# Altium project PW-Sat2_EPS_EM_Battery-Controller.PrjPcb
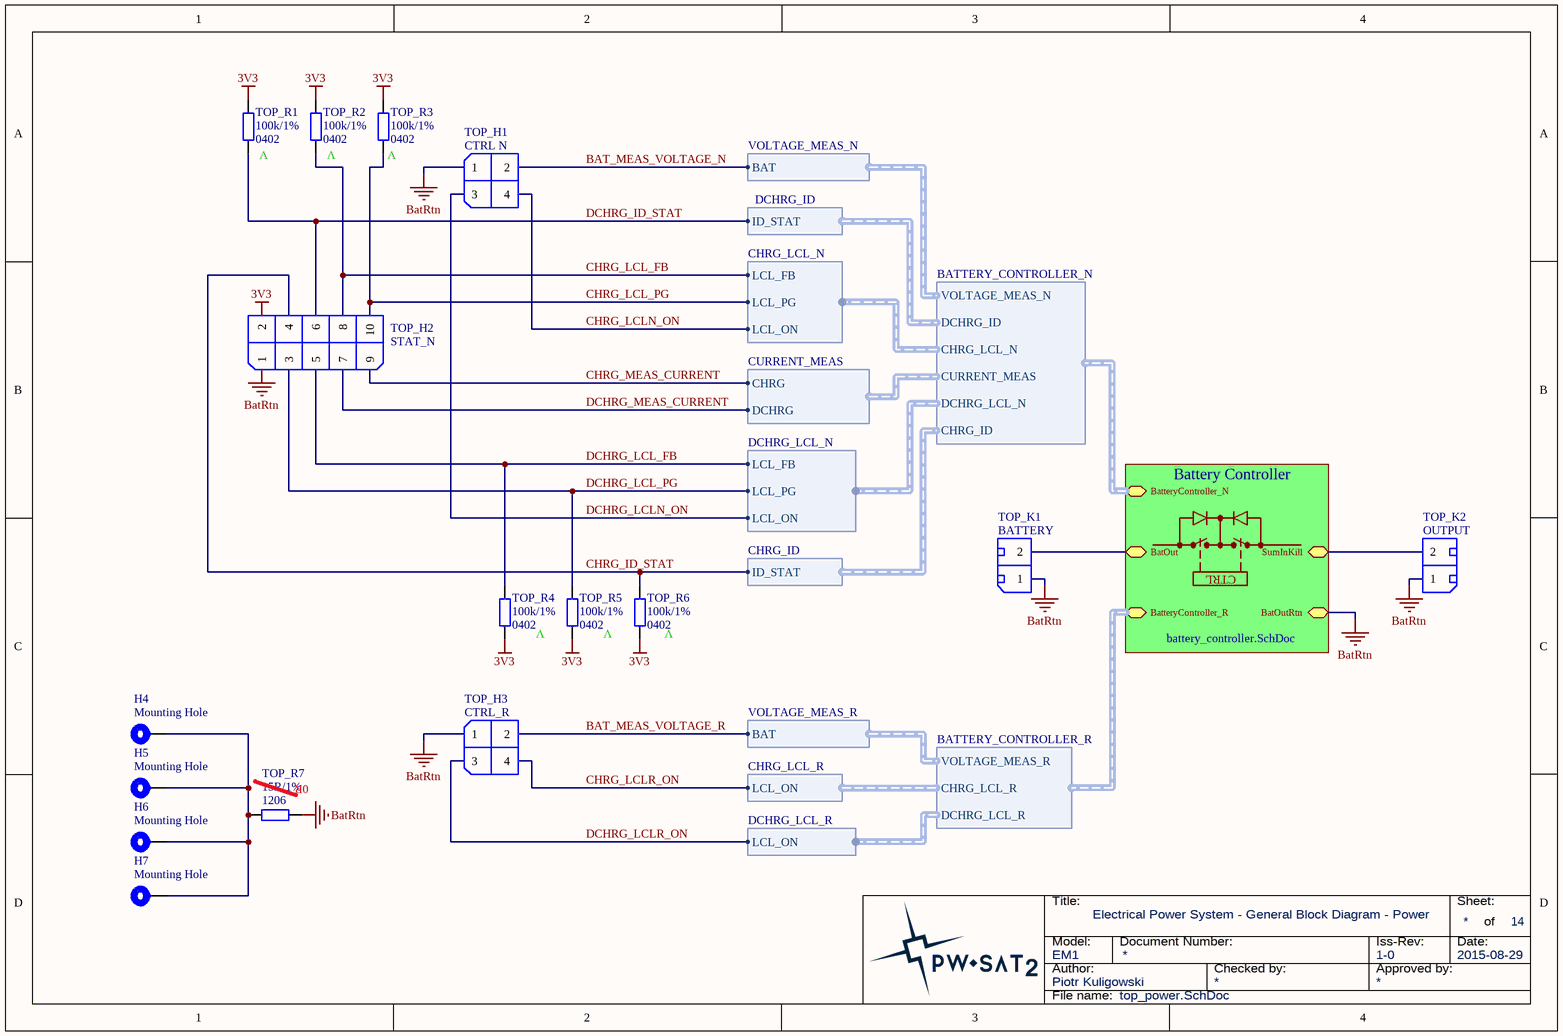
[diagram p0: top_power.SchDoc]
8 sheets, 87 parts. Net scope: hierarchical (ports join the sheet entries above them; power ports are global).
Board file: PW-Sat2_EPS_EM_Battery-Controller.PcbDoc
Sheets:
  top_power.SchDoc
    Battery Controller = battery_controller.SchDoc
      Battery Current Meas. = battery_current-meas.SchDoc
      Battery Charger - Ideal Diode = battery_diode-charging.SchDoc
      Battery Discharger - Ideal Diode = battery_diode-discharging.SchDoc
      Battery Charger - LCL = battery_lcl-charging.SchDoc
      Battery Discharger - LCL = battery_lcl-discharging.SchDoc
      Battery Voltage Meas. = battery_voltage-meas.SchDoc

## Sheet top_power.SchDoc: Electrical Power System - General Block Diagram - Power
size A4; Date: 2015-08-29; Author: Piotr Kuligowski; Revision: 1-0; SheetTotal: 14; Model: EM1; PageSetup: Record=PageOptions|CenterHorizontal=True|CenterVertical=True|PrintScale=0.52|XCorrection=1.00|YCorrection=1.00|PrintKind=1|BorderSize=5000000|LeftOffset=0|BottomOffset=0|Orientation=2|PaperLength=4200|PaperWidth=2970|Scale=100|PaperSource=7|PrintQuality=600|MediaType=1|DitherType=10|PaperKind=A3|PrintScaleMode=1

### Parts
H4  Mounting Hole  [PC-104_PcbMntHole_M3]
H5  Mounting Hole  [PC-104_PcbMntHole_M3]
H6  Mounting Hole  [PC-104_PcbMntHole_M3]
H7  Mounting Hole  [PC-104_PcbMntHole_M3]
TOP_H1  CTRL N  [Harwin_Datamate_L-Tek_M80-8670405]
TOP_H2  STAT_N  [Harwin_Datamate_L-Tek_M80-8671005]
TOP_H3  CTRL_R  [Harwin_Datamate_L-Tek_M80-8670405]
TOP_K1  ProviderPartNumber: BATTERY  [TerminalBlock_Spring_2.54_2-R]  (hidden comment: TB-2.5-PD-xx)
TOP_K2  ProviderPartNumber: OUTPUT  [TerminalBlock_Spring_2.54_2-R]  (hidden comment: TB-2.5-PD-xx)
TOP_R1  Package: 0402  [SMD_Resistor_0402]  (hidden comment: 100k/1%)
TOP_R2  Package: 0402  [SMD_Resistor_0402]  (hidden comment: 100k/1%)
TOP_R3  Package: 0402  [SMD_Resistor_0402]  (hidden comment: 100k/1%)
TOP_R4  Package: 0402  [SMD_Resistor_0402]  (hidden comment: 100k/1%)
TOP_R5  Package: 0402  [SMD_Resistor_0402]  (hidden comment: 100k/1%)
TOP_R6  Package: 0402  [SMD_Resistor_0402]  (hidden comment: 100k/1%)
TOP_R7  Package: 1206  [SMD_Resistor_1206]  (hidden comment: 15R/1%)

### Sub-sheets
Battery Controller = battery_controller.SchDoc: SumInKill, BatOut, BatOutRtn, BatteryController_N (harness BATTERY_CONTROLLER_N), BatteryController_R (harness BATTERY_CONTROLLER_R)

### Harnesses
BATTERY_CONTROLLER_N: DCHRG_ID, CHRG_LCL_N, CURRENT_MEAS, DCHRG_LCL_N, CHRG_ID, VOLTAGE_MEAS_N
VOLTAGE_MEAS_N: BAT
DCHRG_ID: ID_STAT
CHRG_LCL_N: LCL_FB, LCL_PG, LCL_ON
CURRENT_MEAS: CHRG, DCHRG
DCHRG_LCL_N: LCL_FB, LCL_PG, LCL_ON
CHRG_ID: ID_STAT
BATTERY_CONTROLLER_R: DCHRG_LCL_R, CHRG_LCL_R, VOLTAGE_MEAS_R
VOLTAGE_MEAS_R: BAT
CHRG_LCL_R: LCL_ON
DCHRG_LCL_R: LCL_ON

### Nets
3V3: TOP_H2.2 TOP_R1.1 TOP_R2.1 TOP_R3.1 TOP_R4.2 TOP_R5.2 TOP_R6.2
BatRtn: TOP_H1.1 TOP_H2.1 TOP_H3.1 TOP_K1.1 TOP_K2.1 TOP_R7.2 ; sheet Battery Controller/BatOutRtn  [project net BAT_RTN]
BAT_MEAS_VOLTAGE_N: TOP_H1.2 ; harness VOLTAGE_MEAS_N.BAT
BAT_MEAS_VOLTAGE_R: TOP_H3.2 ; harness VOLTAGE_MEAS_R.BAT
CHRG_ID_STAT: TOP_H2.4 TOP_R6.1 ; harness CHRG_ID.ID_STAT
CHRG_LCL_FB: TOP_H2.8 TOP_R2.2 ; harness CHRG_LCL_N.LCL_FB
CHRG_LCL_PG: TOP_H2.10 TOP_R3.2 ; harness CHRG_LCL_N.LCL_PG
CHRG_LCLN_ON: TOP_H1.4 ; harness CHRG_LCL_N.LCL_ON
CHRG_LCLR_ON: TOP_H3.4 ; harness CHRG_LCL_R.LCL_ON
CHRG_MEAS_CURRENT: TOP_H2.9 ; harness CURRENT_MEAS.CHRG
DCHRG_ID_STAT: TOP_H2.6 TOP_R1.2 ; harness DCHRG_ID.ID_STAT
DCHRG_LCL_FB: TOP_H2.5 TOP_R4.1 ; harness DCHRG_LCL_N.LCL_FB
DCHRG_LCL_PG: TOP_H2.3 TOP_R5.1 ; harness DCHRG_LCL_N.LCL_PG
DCHRG_LCLN_ON: TOP_H1.3 ; harness DCHRG_LCL_N.LCL_ON
DCHRG_LCLR_ON: TOP_H3.3 ; harness DCHRG_LCL_R.LCL_ON
DCHRG_MEAS_CURRENT: TOP_H2.7 ; harness CURRENT_MEAS.DCHRG
NetBATV_R1_1: TOP_K1.2 ; sheet Battery Controller/BatOut
NetCHRG_C3_1: TOP_K2.2 ; sheet Battery Controller/SumInKill
NetH4_1: H4.1 H5.1 H6.1 H7.1 TOP_R7.1

### Notes on the sheet
- (near TOP_R1) V
- (near TOP_R2) V
- (near TOP_R3) V
- CTRL
- (near TOP_R5) V
- (near TOP_R6) V
- (near TOP_R7) 0R
- Title:
- Sheet:
- of
- Author:
- Model:
- Document Number:
- Checked by:
- Iss-Rev:
- Approved by:
- Date:
- File name:

### Library data of the parts
H4-H7 = MntHole: PCB Mounting Hole; Value: Mounting Hole
TOP_H1 TOP_H3 = Harwin_Datamate_L-Tek_2x2pin: Harwin DataMate L-Tek, 2mm pitch, 2x2pin.; Value: Harwin DataMate L-Tek 2x2pin
TOP_H2 = Harwin_Datamate_L-Tek_2x5pin: Harwin DataMate L-Tek, 2mm pitch, 2x5pin.; Value: Harwin DataMate L-Tek 2x5pin
TOP_K1 TOP_K2 = TerminalBlock_Spring_2.54_2-R: Terminal block with spring, 2-pin, 2.54mm pitch, right angle.; Provider: TME.eu; Value: TB-2.5-PD-xx
TOP_R1-TOP_R6 = CRCW0402100KFKxxxx: 100k/1% Vishay CRCW 0402 Resistor. 63mW, 100ppm, 50V.; Manufacturer: Vishay; Value: 100k/1%
TOP_R7 = CRCW120615R0FKxxxx: 15R/1% Vishay CRCW 1206 Resistor. 250mW, 100ppm, 200V.; ManufacturerPartNumber: CRCW120615R0FKxxxx; Manufacturer: Vishay; Value: 15R/1%

## Sheet battery_controller.SchDoc: Battery Controller
size A3; Date: 2015-09-21; Author: Piotr Kuligowski; DocumentNumber: 1; Revision: 1-0; SheetNumber: 1; SheetTotal: 14; Model: EM1
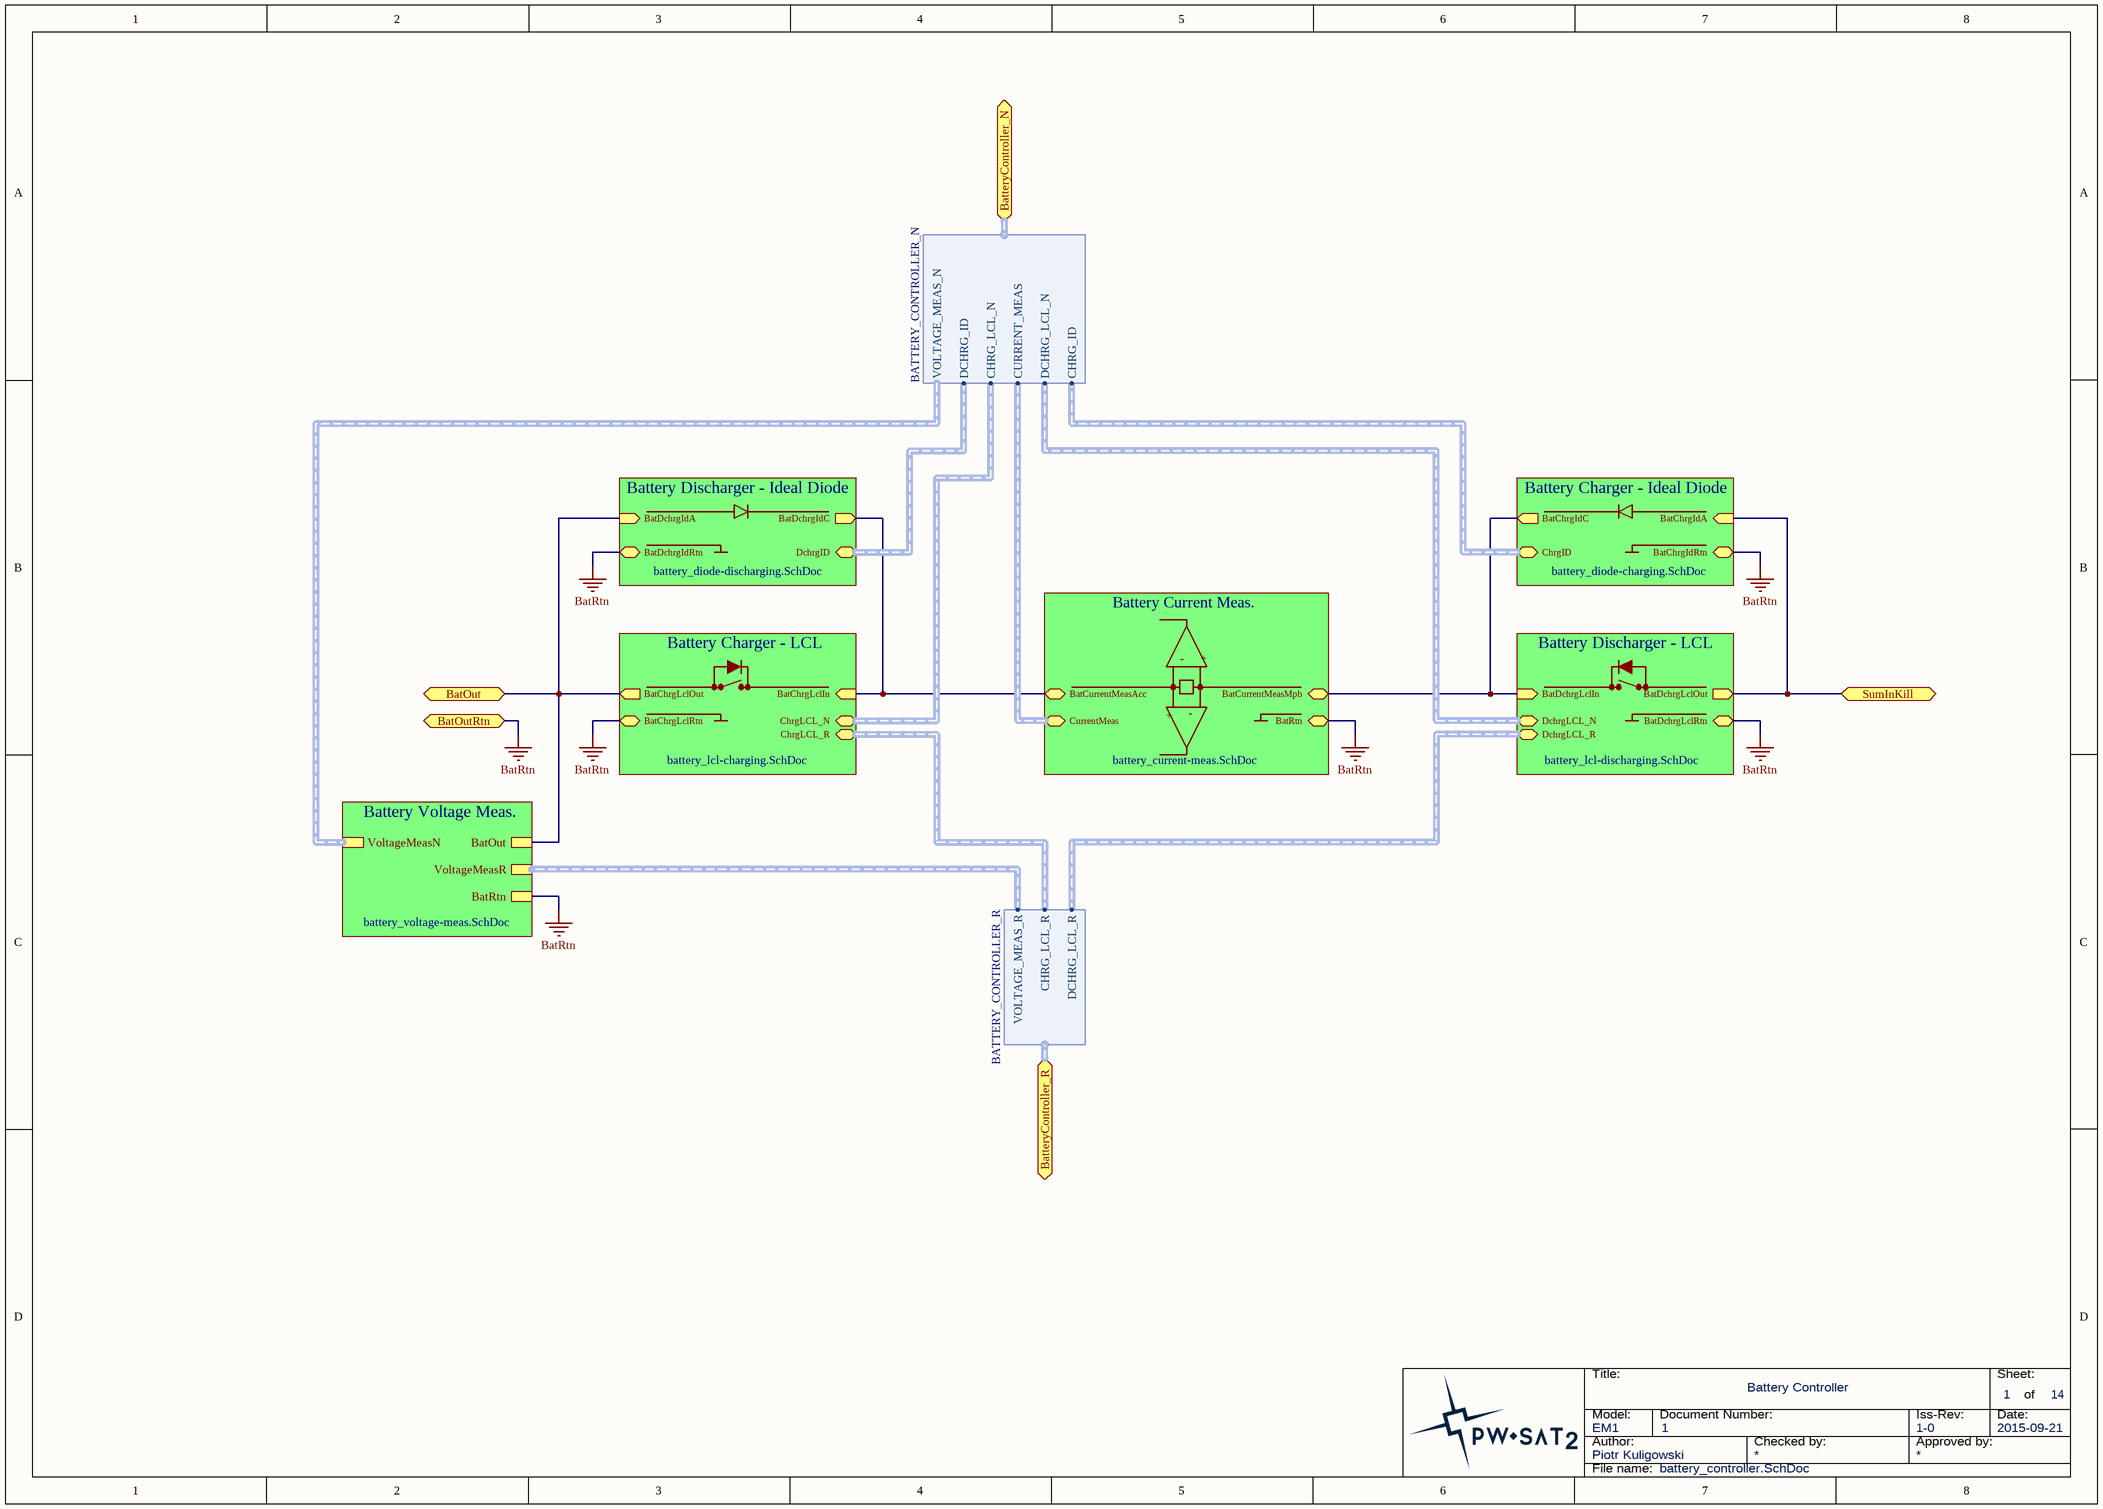
[diagram p1: battery_controller.SchDoc]

### Sub-sheets
Battery Charger - Ideal Diode = battery_diode-charging.SchDoc: BatChrgIdRtn, BatChrgIdA (in), ChrgID (harness CHRG_ID), BatChrgIdC (out)
Battery Charger - LCL = battery_lcl-charging.SchDoc: BatChrgLclIn (in), BatChrgLclRtn, BatChrgLclOut (out), ChrgLCL_N (harness CHRG_LCL_N), ChrgLCL_R (harness CHRG_LCL_R)
Battery Current Meas. = battery_current-meas.SchDoc: BatCurrentMeasMpb, BatRtn, BatCurrentMeasAcc, CurrentMeas (harness CURRENT_MEAS)
Battery Discharger - Ideal Diode = battery_diode-discharging.SchDoc: BatDchrgIdRtn, BatDchrgIdA (in), DchrgID (harness DCHRG_ID), BatDchrgIdC (out)
Battery Discharger - LCL = battery_lcl-discharging.SchDoc: BatDchrgLclIn (in), BatDchrgLclRtn, BatDchrgLclOut (out), DchrgLCL_N (harness DCHRG_LCL_N), DchrgLCL_R (harness DCHRG_LCL_R)
Battery Voltage Meas. = battery_voltage-meas.SchDoc: BatOut, VoltageMeasN (harness VOLTAGE_MEAS_N), VoltageMeasR (harness VOLTAGE_MEAS_R), BatRtn

### Ports
BatOut, BatOutRtn, BatteryController_N (harness BATTERY_CONTROLLER_N), BatteryController_R (harness BATTERY_CONTROLLER_R), SumInKill

### Harnesses
BATTERY_CONTROLLER_N: DCHRG_ID, CHRG_LCL_N, CURRENT_MEAS, DCHRG_LCL_N, CHRG_ID, VOLTAGE_MEAS_N
BATTERY_CONTROLLER_R: DCHRG_LCL_R, CHRG_LCL_R, VOLTAGE_MEAS_R

### Nets
BatRtn: port BatOutRtn, sheet Battery Current Meas./BatRtn, sheet Battery Charger - Ideal Diode/BatChrgIdRtn, sheet Battery Discharger - Ideal Diode/BatDchrgIdRtn, sheet Battery Charger - LCL/BatChrgLclRtn, sheet Battery Discharger - LCL/BatDchrgLclRtn, sheet Battery Voltage Meas./BatRtn  [project net BAT_RTN]
NetBAT_C1_1: sheet Battery Current Meas./BatCurrentMeasAcc, sheet Battery Discharger - Ideal Diode/BatDchrgIdC, sheet Battery Charger - LCL/BatChrgLclIn
NetBAT_C2_1: sheet Battery Current Meas./BatCurrentMeasMpb, sheet Battery Charger - Ideal Diode/BatChrgIdC, sheet Battery Discharger - LCL/BatDchrgLclIn
NetBATV_R1_1: port BatOut, sheet Battery Discharger - Ideal Diode/BatDchrgIdA, sheet Battery Charger - LCL/BatChrgLclOut, sheet Battery Voltage Meas./BatOut
NetCHRG_C3_1: port SumInKill, sheet Battery Charger - Ideal Diode/BatChrgIdA, sheet Battery Discharger - LCL/BatDchrgLclOut

### Notes on the sheet
- +
- -
- Title:
- Sheet:
- of
- Author:
- Model:
- Document Number:
- Checked by:
- Iss-Rev:
- Approved by:
- Date:
- File name:

## Sheet battery_current-meas.SchDoc: Battery Current Measurement
size A4; Date: 2015-09-21; Author: Piotr Kuligowski; DocumentNumber: 1; Revision: 1-0; SheetNumber: 1; SheetTotal: 14; Model: EM1
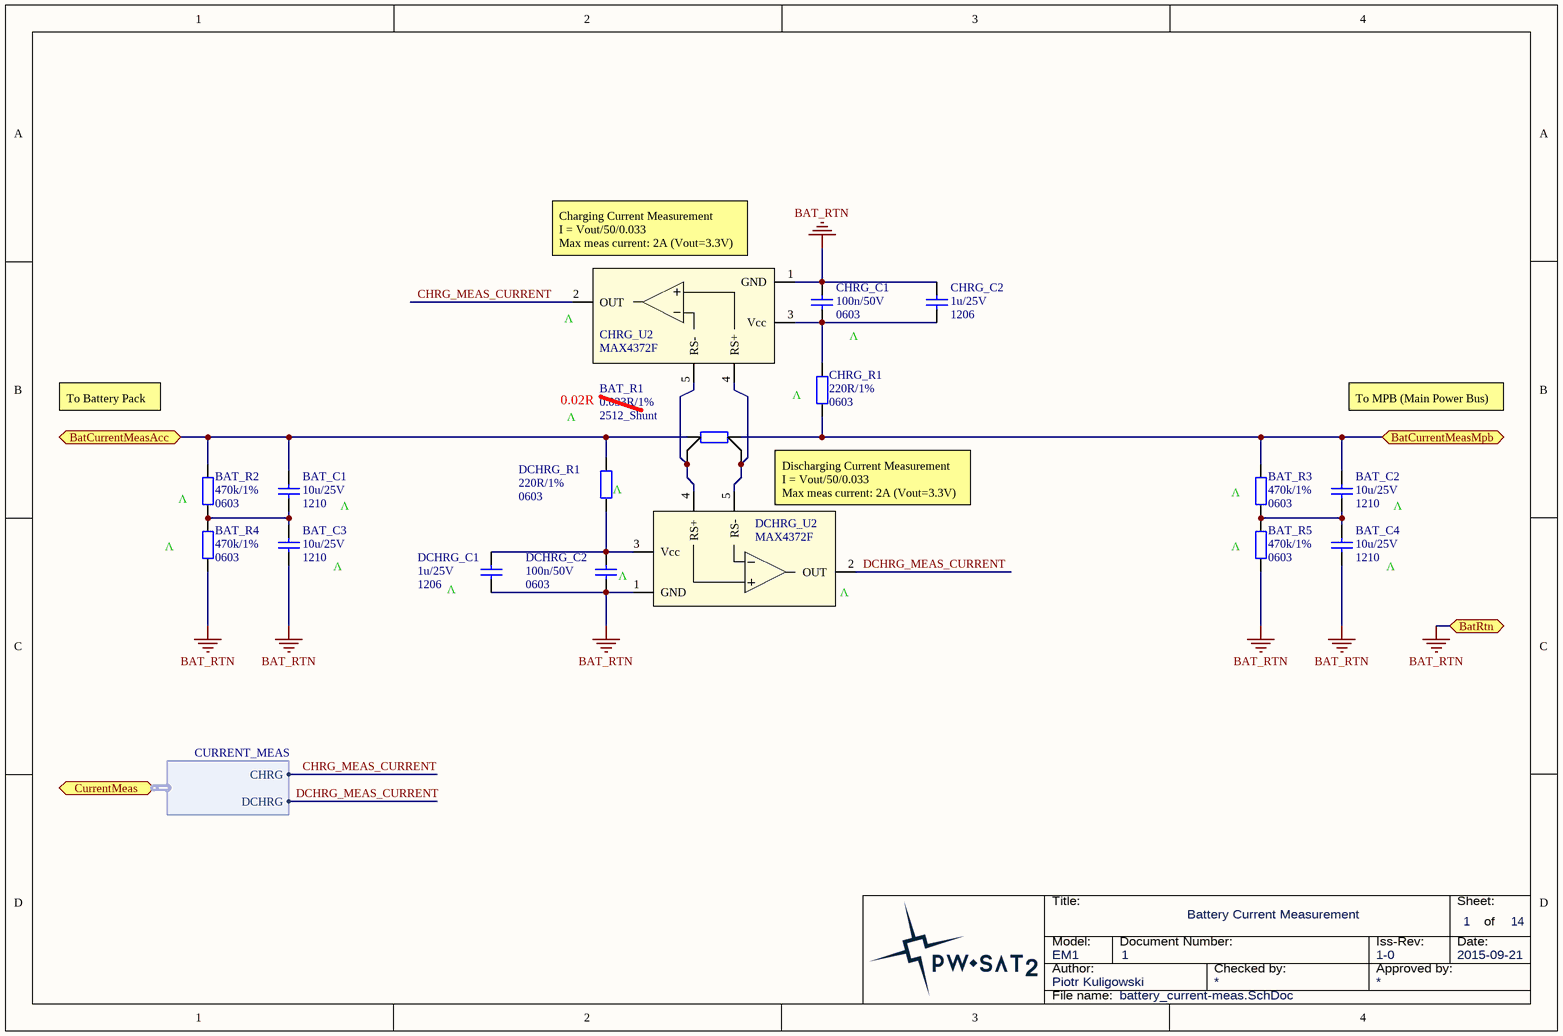
[diagram p2: battery_current-meas.SchDoc]

### Parts
BAT_C1  Package: 1210  [SMD_Capacitor_1210]  (hidden comment: 10u/25V)
BAT_C2  Package: 1210  [SMD_Capacitor_1210]  (hidden comment: 10u/25V)
BAT_C3  Package: 1210  [SMD_Capacitor_1210]  (hidden comment: 10u/25V)
BAT_C4  Package: 1210  [SMD_Capacitor_1210]  (hidden comment: 10u/25V)
BAT_R1  Package: 2512_Shunt  [SMD_Resistor-shunt_2512]  (hidden comment: 0.033R/1%)
BAT_R2  Package: 0603  [SMD_Resistor_0603]  (hidden comment: 470k/1%)
BAT_R3  Package: 0603  [SMD_Resistor_0603]  (hidden comment: 470k/1%)
BAT_R4  Package: 0603  [SMD_Resistor_0603]  (hidden comment: 470k/1%)
BAT_R5  Package: 0603  [SMD_Resistor_0603]  (hidden comment: 470k/1%)
CHRG_C1  Package: 0603  [SMD_Capacitor_0603]  (hidden comment: 100n/50V)
CHRG_C2  Package: 1206  [SMD_Capacitor_1206]  (hidden comment: 1u/25V)
CHRG_R1  Package: 0603  [SMD_Resistor_0603]  (hidden comment: 220R/1%)
CHRG_U2  MAX4372F  [SOT23-5]
DCHRG_C1  Package: 1206  [SMD_Capacitor_1206]  (hidden comment: 1u/25V)
DCHRG_C2  Package: 0603  [SMD_Capacitor_0603]  (hidden comment: 100n/50V)
DCHRG_R1  Package: 0603  [SMD_Resistor_0603]  (hidden comment: 220R/1%)
DCHRG_U2  MAX4372F  [SOT23-5]

### Ports
BatCurrentMeasAcc, BatCurrentMeasMpb, BatRtn, CurrentMeas (harness CURRENT_MEAS)

### Harnesses
CURRENT_MEAS: CHRG, DCHRG

### Nets
BAT_RTN: BAT_C3.2 BAT_C4.2 BAT_R4.2 BAT_R5.2 CHRG_C1.1 CHRG_C2.1 CHRG_U2.1(GND) DCHRG_C1.2 DCHRG_C2.2 DCHRG_U2.1(GND) ; port BatRtn
CHRG_MEAS_CURRENT: CHRG_U2.2(OUT) ; port CurrentMeas.CHRG
DCHRG_MEAS_CURRENT: DCHRG_U2.2(OUT) ; port CurrentMeas.DCHRG
NetBAT_C1_1: BAT_C1.1 BAT_R1.1 BAT_R2.1 DCHRG_R1.1 ; port BatCurrentMeasAcc
NetBAT_C1_2: BAT_C1.2 BAT_C3.1 BAT_R2.2 BAT_R4.1
NetBAT_C2_1: BAT_C2.1 BAT_R1.4 BAT_R3.1 CHRG_R1.1 ; port BatCurrentMeasMpb
NetBAT_C2_2: BAT_C2.2 BAT_C4.1 BAT_R3.2 BAT_R5.1
NetBAT_R1_2: BAT_R1.2 CHRG_U2.5(RS-) DCHRG_U2.4(RS+)
NetBAT_R1_3: BAT_R1.3 CHRG_U2.4(RS+) DCHRG_U2.5(RS-)
NetCHRG_C1_2: CHRG_C1.2 CHRG_C2.2 CHRG_R1.2 CHRG_U2.3(Vcc)
NetDCHRG_C1_1: DCHRG_C1.1 DCHRG_C2.1 DCHRG_R1.2 DCHRG_U2.3(Vcc)

### Notes on the sheet
- (near CHRG_U2) Charging Current Measurement
  I = Vout/50/0.033
  Max meas current: 2A (Vout=3.3V)
- (near CHRG_U2) V
- (near CHRG_R1) V
- V
- To Battery Pack
- (near CHRG_U2) 0.02R
- To MPB (Main Power Bus)
- (near BAT_R2) V
- (near DCHRG_R1) V
- (near DCHRG_U2) Discharging Current Measurement
  I = Vout/50/0.033
  Max meas current: 2A (Vout=3.3V)
- (near BAT_R3) V
- (near DCHRG_C1) V
- (near DCHRG_U2) V
- (near BAT_R5) V
- Title:
- Sheet:
- of
- Author:
- Model:
- Document Number:
- Checked by:
- Iss-Rev:
- Approved by:
- Date:
- File name:

### Library data of the parts
BAT_C1-BAT_C4 = Cer_GCJ32ER71E106KA12L: Ceramic Cap Murata Automotive 10u/25V X7R 1210; Manufacturer: Murata; ManufacturerPartNumber: GCJ32ER71E106KA12L; Value: 10u/25V
BAT_R1 = LR2512-R033FW: 33mR ,1%, 2W, shunt resistor, TE Connectivity.; ManufacturerPartNumber: LR2512-R033FW; Manufacturer: TE Connectivity; Power Rating: 2W; Value: 0.033R/1%
BAT_R2-BAT_R5 = CRCW0603470KFKxxxx: 470k/1% Vishay CRCW 0603 Resistor. 100mW, 100ppm, 75V.; Manufacturer: Vishay; ManufacturerPartNumber: CRCW0603470KFKxxxx; Value: 470k/1%
CHRG_C1 DCHRG_C2 = Cer_GCJ188R71H104KA12D: Ceramic Cap Murata Automotive 100n/50V X7R 0603; Manufacturer: Murata; ManufacturerPartNumber: GCJ188R71H104KA12D; Value: 100n/50V
CHRG_C2 DCHRG_C1 = Cer_C1206T105K3RALTU: Ceramic Cap Kemet COTS 1u/25V X7R 1206; ManufacturerPartNumber: C1206T105K3RALTU; Manufacturer: Kemet; Value: 1u/25V
CHRG_R1 DCHRG_R1 = CRCW0603220RFKxxxx: 220R/1% Vishay CRCW 0603 Resistor. 100mW, 100ppm, 75V.; ManufacturerPartNumber: CRCW0603220RFKxxxx; Manufacturer: Vishay; Value: 220R/1%
CHRG_U2 DCHRG_U2 = MAX4372: High-Side Current-Sense Amplifier with Voltage Output; Manufacturer: Maxim Integrated Products; Value: MAX4372F

## Sheet battery_diode-charging.SchDoc: Battery Charging - Ideal Diode
size A4; Date: 2015-09-22; Author: Piotr Kuligowski; DocumentNumber: 1; Revision: 1-0; SheetNumber: 1; SheetTotal: 14; Model: EM1
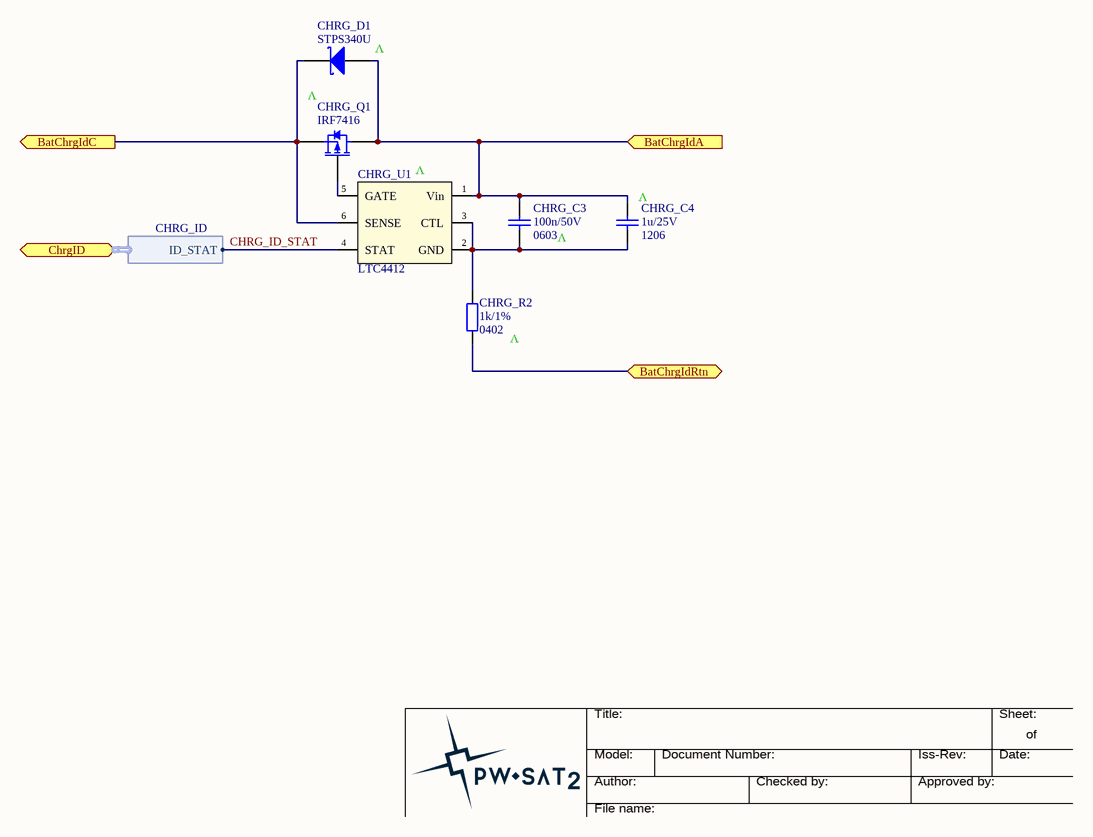
[diagram p3: battery_diode-charging.SchDoc]

### Parts
CHRG_C3  Package: 0603  [SMD_Capacitor_0603]  (hidden comment: 100n/50V)
CHRG_C4  Package: 1206  [SMD_Capacitor_1206]  (hidden comment: 1u/25V)
CHRG_D1  STPS340U  [DO-214AA]
CHRG_Q1  IRF7416  [SOIC-8-N_SSSGDDDD]
CHRG_R2  Package: 0402  [SMD_Resistor_0402]  (hidden comment: 1k/1%)
CHRG_U1  LTC4412  [SOT23-6]

### Ports
BatChrgIdA (in), BatChrgIdC (out), BatChrgIdRtn, ChrgID (harness CHRG_ID)

### Harnesses
CHRG_ID: ID_STAT

### Nets
BAT_RTN: CHRG_R2.2 ; port BatChrgIdRtn
CHRG_ID_STAT: CHRG_U1.4(STAT) ; port ChrgID.ID_STAT
NetBAT_C2_1: CHRG_D1.K CHRG_Q1.S CHRG_U1.6(SENSE) ; port BatChrgIdC
NetCHRG_C3_1: CHRG_C3.1 CHRG_C4.1 CHRG_D1.A CHRG_Q1.D CHRG_U1.1(Vin) ; port BatChrgIdA
NetCHRG_C3_2: CHRG_C3.2 CHRG_C4.2 CHRG_R2.1 CHRG_U1.2(GND) CHRG_U1.3(CTL)
NetCHRG_Q1_G: CHRG_Q1.G CHRG_U1.5(GATE)

### Notes on the sheet
- (near CHRG_D1) V
- V
- (near CHRG_U1) V
- (near CHRG_C4) V
- (near CHRG_R2) V
- Title:
- Sheet:
- of
- Author:
- Model:
- Document Number:
- Checked by:
- Iss-Rev:
- Approved by:
- Date:
- File name:

### Library data of the parts
CHRG_C3 = Cer_GCJ188R71H104KA12D: as CHRG_C1 on sheet battery_current-meas; Manufacturer: Murata; ManufacturerPartNumber: GCJ188R71H104KA12D; Value: 100n/50V
CHRG_C4 = Cer_C1206T105K3RALTU: Ceramic Cap Kemet COTS 1u/25V X7R 1206; ManufacturerPartNumber: C1206T105K3RALTU; Manufacturer: Kemet; Value: 1u/25V
CHRG_D1 = STPS340x: 3A/40V Power Schottky Rectifier.; Manufacturer: STMicroelectronics; Value: STPS340U
CHRG_Q1 = IRF7416: 10A/30V HEXFET Power P-MOSFET.; Manufacturer: International Rectifier; Value: IRF7416
CHRG_R2 = CRCW04021K00FKxxxx: 1k/1% Vishay CRCW 0402 Resistor. 63mW, 100ppm, 50V.; Manufacturer: Vishay; ManufacturerPartNumber: CRCW04021K00FKxxxx; Value: 1k/1%
CHRG_U1 = LTC4412: Ideal Diode, Low Loss PowerPath Controller.; Manufacturer: Linear Technology; Value: LTC4412

## Sheet battery_diode-discharging.SchDoc: Battery Discharging - Ideal Diode
size A4; Date: 2015-09-22; Author: Piotr Kuligowski; DocumentNumber: 1; Revision: 1-0; SheetNumber: 1; SheetTotal: 14; Model: EM1
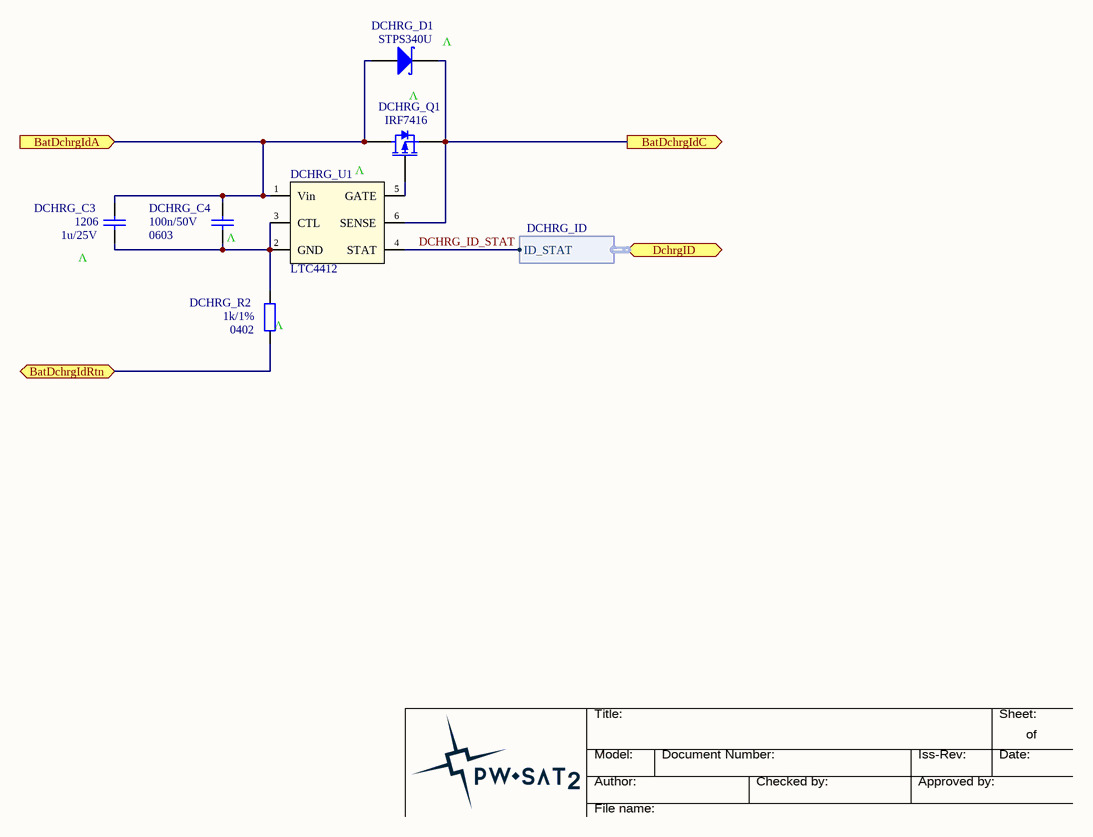
[diagram p4: battery_diode-discharging.SchDoc]

### Parts
DCHRG_C3  Package: 1206  [SMD_Capacitor_1206]  (hidden comment: 1u/25V)
DCHRG_C4  Package: 0603  [SMD_Capacitor_0603]  (hidden comment: 100n/50V)
DCHRG_D1  STPS340U  [DO-214AA]
DCHRG_Q1  IRF7416  [SOIC-8-N_SSSGDDDD]
DCHRG_R2  Package: 0402  [SMD_Resistor_0402]  (hidden comment: 1k/1%)
DCHRG_U1  LTC4412  [SOT23-6]

### Ports
BatDchrgIdA (in), BatDchrgIdC (out), BatDchrgIdRtn, DchrgID (harness DCHRG_ID)

### Harnesses
DCHRG_ID: ID_STAT

### Nets
BAT_RTN: DCHRG_R2.2 ; port BatDchrgIdRtn
DCHRG_ID_STAT: DCHRG_U1.4(STAT) ; port DchrgID.ID_STAT
NetBAT_C1_1: DCHRG_D1.K DCHRG_Q1.S DCHRG_U1.6(SENSE) ; port BatDchrgIdC
NetBATV_R1_1: DCHRG_C3.1 DCHRG_C4.1 DCHRG_D1.A DCHRG_Q1.D DCHRG_U1.1(Vin) ; port BatDchrgIdA
NetDCHRG_C3_2: DCHRG_C3.2 DCHRG_C4.2 DCHRG_R2.1 DCHRG_U1.2(GND) DCHRG_U1.3(CTL)
NetDCHRG_Q1_G: DCHRG_Q1.G DCHRG_U1.5(GATE)

### Notes on the sheet
- (near DCHRG_D1) V
- V
- (near DCHRG_C3) V
- (near DCHRG_C4) V
- (near DCHRG_R2) V
- Title:
- Sheet:
- of
- Author:
- Model:
- Document Number:
- Checked by:
- Iss-Rev:
- Approved by:
- Date:
- File name:

### Library data of the parts
DCHRG_C3 = Cer_C1206T105K3RALTU: Ceramic Cap Kemet COTS 1u/25V X7R 1206; ManufacturerPartNumber: C1206T105K3RALTU; Manufacturer: Kemet; Value: 1u/25V
DCHRG_C4 = Cer_GCJ188R71H104KA12D: as CHRG_C1 on sheet battery_current-meas; Manufacturer: Murata; ManufacturerPartNumber: GCJ188R71H104KA12D; Value: 100n/50V
DCHRG_D1 = STPS340x: as CHRG_D1 on sheet battery_diode-charging; Value: STPS340U
DCHRG_Q1 = IRF7416: as CHRG_Q1 on sheet battery_diode-charging; Value: IRF7416
DCHRG_R2 = CRCW04021K00FKxxxx: as CHRG_R2 on sheet battery_diode-charging; Manufacturer: Vishay; ManufacturerPartNumber: CRCW04021K00FKxxxx; Value: 1k/1%
DCHRG_U1 = LTC4412: as CHRG_U1 on sheet battery_diode-charging; Value: LTC4412

## Sheet battery_lcl-charging.SchDoc: Battery Charger - LCL
size A4; Date: 2015-09-21; Author: Piotr Kuligowski; DocumentNumber: 1; Revision: 1-0; SheetNumber: 1; SheetTotal: 14; Model: EM1
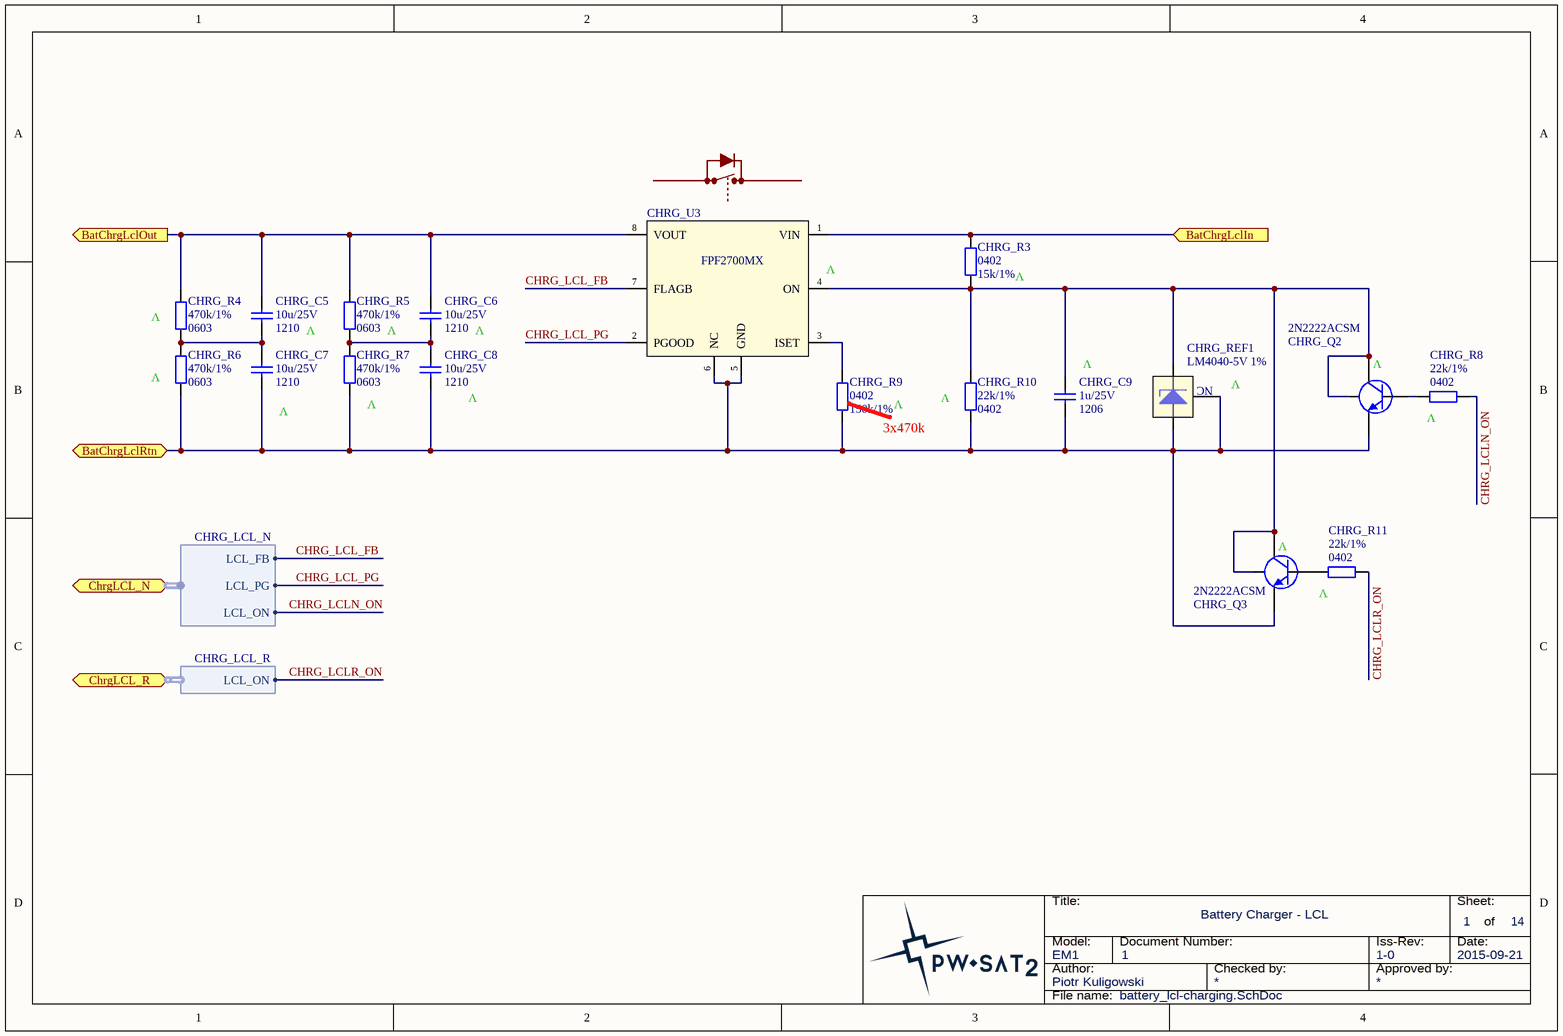
[diagram p5: battery_lcl-charging.SchDoc]

### Parts
CHRG_C5  Package: 1210  [SMD_Capacitor_1210]  (hidden comment: 10u/25V)
CHRG_C6  Package: 1210  [SMD_Capacitor_1210]  (hidden comment: 10u/25V)
CHRG_C7  Package: 1210  [SMD_Capacitor_1210]  (hidden comment: 10u/25V)
CHRG_C8  Package: 1210  [SMD_Capacitor_1210]  (hidden comment: 10u/25V)
CHRG_C9  Package: 1206  [SMD_Capacitor_1206]  (hidden comment: 1u/25V)
CHRG_Q2  2N2222ACSM  [LCC1-4_BEC]
CHRG_Q3  2N2222ACSM  [LCC1-4_BEC]
CHRG_R3  Package: 0402  [SMD_Resistor_0402]  (hidden comment: 15k/1%)
CHRG_R4  Package: 0603  [SMD_Resistor_0603]  (hidden comment: 470k/1%)
CHRG_R5  Package: 0603  [SMD_Resistor_0603]  (hidden comment: 470k/1%)
CHRG_R6  Package: 0603  [SMD_Resistor_0603]  (hidden comment: 470k/1%)
CHRG_R7  Package: 0603  [SMD_Resistor_0603]  (hidden comment: 470k/1%)
CHRG_R8  Package: 0402  [SMD_Resistor_0402]  (hidden comment: 22k/1%)
CHRG_R9  Package: 0402  [SMD_Resistor_0402]  (hidden comment: 150k/1%)
CHRG_R10  Package: 0402  [SMD_Resistor_0402]  (hidden comment: 22k/1%)
CHRG_R11  Package: 0402  [SMD_Resistor_0402]  (hidden comment: 22k/1%)
CHRG_REF1  LM4040-5V 1%  [SOT23-3]
CHRG_U3  FPF2700MX  [SOIC-8-N]

### Ports
BatChrgLclIn (in), BatChrgLclOut (out), BatChrgLclRtn, ChrgLCL_N (harness CHRG_LCL_N), ChrgLCL_R (harness CHRG_LCL_R)

### Harnesses
CHRG_LCL_N: LCL_FB, LCL_PG, LCL_ON
CHRG_LCL_R: LCL_ON

### Nets
BAT_RTN: CHRG_C7.2 CHRG_C8.2 CHRG_C9.2 CHRG_Q2.E CHRG_Q3.E CHRG_R6.2 CHRG_R7.2 CHRG_R9.2 CHRG_R10.2 CHRG_REF1.2(A) CHRG_REF1.3(NC) CHRG_U3.5(GND) CHRG_U3.6(NC) ; port BatChrgLclRtn
CHRG_LCL_FB: CHRG_U3.7(FLAGB) ; port ChrgLCL_N.LCL_FB
CHRG_LCL_PG: CHRG_U3.2(PGOOD) ; port ChrgLCL_N.LCL_PG
CHRG_LCLN_ON: CHRG_R8.2 ; port ChrgLCL_N.LCL_ON
CHRG_LCLR_ON: CHRG_R11.2 ; port ChrgLCL_R.LCL_ON
NetBAT_C1_1: CHRG_R3.1 CHRG_U3.1(VIN) ; port BatChrgLclIn
NetBATV_R1_1: CHRG_C5.1 CHRG_C6.1 CHRG_R4.1 CHRG_R5.1 CHRG_U3.8(VOUT) ; port BatChrgLclOut
NetCHRG_C5_2: CHRG_C5.2 CHRG_C7.1 CHRG_R4.2 CHRG_R6.1
NetCHRG_C6_2: CHRG_C6.2 CHRG_C8.1 CHRG_R5.2 CHRG_R7.1
NetCHRG_C9_1: CHRG_C9.1 CHRG_Q2.C CHRG_Q2.Shield CHRG_Q3.C CHRG_Q3.Shield CHRG_R3.2 CHRG_R10.1 CHRG_REF1.1(K) CHRG_U3.4(ON)
NetCHRG_Q2_B: CHRG_Q2.B CHRG_R8.1
NetCHRG_Q3_B: CHRG_Q3.B CHRG_R11.1
NetCHRG_R9_1: CHRG_R9.1 CHRG_U3.3(ISET)

### Notes on the sheet
- (near CHRG_R4) V
- (near CHRG_U3) V
- V
- (near CHRG_R6) V
- (near CHRG_C8) V
- (near CHRG_R10) V
- (near CHRG_C9) V
- (near CHRG_REF1) V
- (near CHRG_Q2) V
- (near CHRG_R7) V
- 3x470k
- (near CHRG_R8) V
- (near CHRG_Q3) V
- (near CHRG_R11) V
- Title:
- Sheet:
- of
- Author:
- Model:
- Document Number:
- Checked by:
- Iss-Rev:
- Approved by:
- Date:
- File name:

### Library data of the parts
CHRG_C5-CHRG_C8 = Cer_GCJ32ER71E106KA12L: as BAT_C1 on sheet battery_current-meas; Manufacturer: Murata; ManufacturerPartNumber: GCJ32ER71E106KA12L; Value: 10u/25V
CHRG_C9 = Cer_C1206T105K3RALTU: Ceramic Cap Kemet COTS 1u/25V X7R 1206; ManufacturerPartNumber: C1206T105K3RALTU; Manufacturer: Kemet; Value: 1u/25V
CHRG_Q2 CHRG_Q3 = 2N2222ACSM: Silicon Planar Epitaxial NPN Transistor.; Manufacturer: Semelab-TT; Value: 2N2222ACSM
CHRG_R3 = CRCW040215K0FKxxxx: 15k/1% Vishay CRCW 0402 Resistor. 63mW, 100ppm, 50V.; Manufacturer: Vishay; ManufacturerPartNumber: CRCW040215K0FKxxxx; Value: 15k/1%
CHRG_R4-CHRG_R7 = CRCW0603470KFKxxxx: as BAT_R2 on sheet battery_current-meas; Manufacturer: Vishay; ManufacturerPartNumber: CRCW0603470KFKxxxx; Value: 470k/1%
CHRG_R8 CHRG_R10 CHRG_R11 = CRCW040222K0FKxxxx: 22k/1% Vishay CRCW 0402 Resistor. 63mW, 100ppm, 50V.; Manufacturer: Vishay; ManufacturerPartNumber: CRCW040222K0FKxxxx; Value: 22k/1%
CHRG_R9 = CRCW0402150KFKxxxx: 150k/1% Vishay CRCW 0402 Resistor. 63mW, 100ppm, 50V.; Manufacturer: Vishay; ManufacturerPartNumber: CRCW0402150KFKxxxx; Value: 150k/1%
CHRG_REF1 = LM4040DIM3-5.0: Shunt V-REF, 5V, 1%, SOT23-3; Manufacturer: Texas Instruments; ManufacturerPartNumber: LM4040DIM3-5.0; Value: LM4040-5V 1%
CHRG_U3 = FPF2700MX: Adj over-current protection 0.4-2A, Load Switch; Manufacturer: Fairchild Semiconductor; Value: FPF2700MX

## Sheet battery_lcl-discharging.SchDoc: Battery Discharger - LCL
size A4; Date: 2015-09-21; Author: Piotr Kuligowski; DocumentNumber: 1; Revision: 1-0; SheetNumber: 1; SheetTotal: 14; Model: EM1
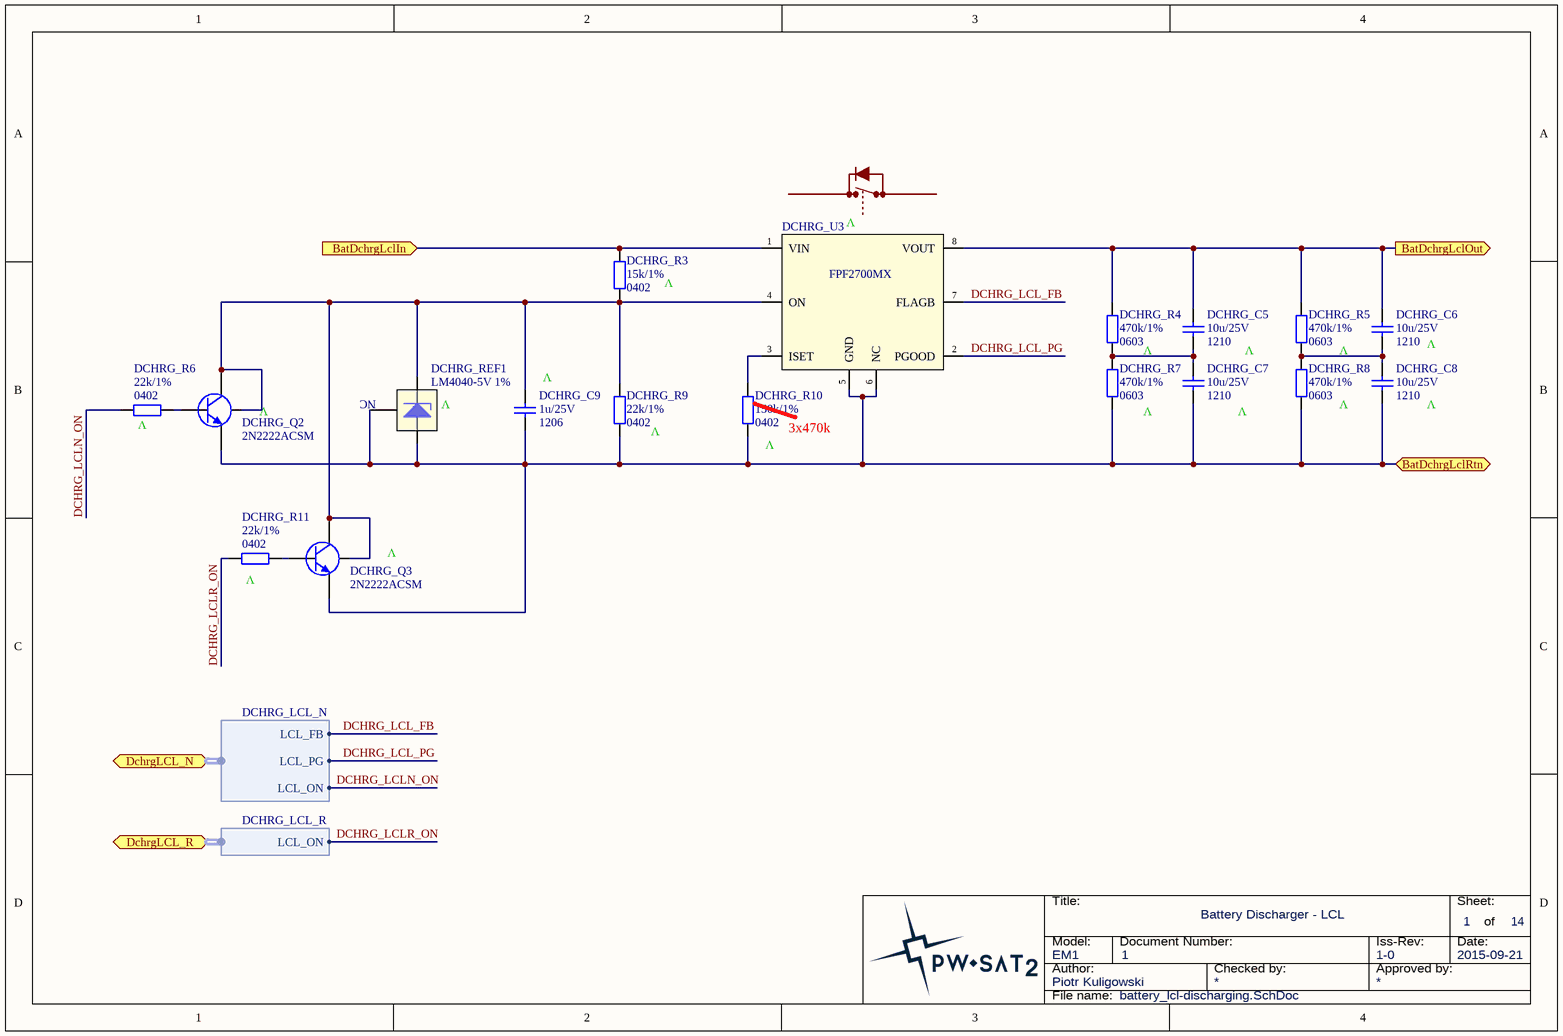
[diagram p6: battery_lcl-discharging.SchDoc]

### Parts
DCHRG_C5  Package: 1210  [SMD_Capacitor_1210]  (hidden comment: 10u/25V)
DCHRG_C6  Package: 1210  [SMD_Capacitor_1210]  (hidden comment: 10u/25V)
DCHRG_C7  Package: 1210  [SMD_Capacitor_1210]  (hidden comment: 10u/25V)
DCHRG_C8  Package: 1210  [SMD_Capacitor_1210]  (hidden comment: 10u/25V)
DCHRG_C9  Package: 1206  [SMD_Capacitor_1206]  (hidden comment: 1u/25V)
DCHRG_Q2  2N2222ACSM  [LCC1-4_BEC]
DCHRG_Q3  2N2222ACSM  [LCC1-4_BEC]
DCHRG_R3  Package: 0402  [SMD_Resistor_0402]  (hidden comment: 15k/1%)
DCHRG_R4  Package: 0603  [SMD_Resistor_0603]  (hidden comment: 470k/1%)
DCHRG_R5  Package: 0603  [SMD_Resistor_0603]  (hidden comment: 470k/1%)
DCHRG_R6  Package: 0402  [SMD_Resistor_0402]  (hidden comment: 22k/1%)
DCHRG_R7  Package: 0603  [SMD_Resistor_0603]  (hidden comment: 470k/1%)
DCHRG_R8  Package: 0603  [SMD_Resistor_0603]  (hidden comment: 470k/1%)
DCHRG_R9  Package: 0402  [SMD_Resistor_0402]  (hidden comment: 22k/1%)
DCHRG_R10  Package: 0402  [SMD_Resistor_0402]  (hidden comment: 150k/1%)
DCHRG_R11  Package: 0402  [SMD_Resistor_0402]  (hidden comment: 22k/1%)
DCHRG_REF1  LM4040-5V 1%  [SOT23-3]
DCHRG_U3  FPF2700MX  [SOIC-8-N]

### Ports
BatDchrgLclIn (in), BatDchrgLclOut (out), BatDchrgLclRtn, DchrgLCL_N (harness DCHRG_LCL_N), DchrgLCL_R (harness DCHRG_LCL_R)

### Harnesses
DCHRG_LCL_N: LCL_FB, LCL_PG, LCL_ON
DCHRG_LCL_R: LCL_ON

### Nets
BAT_RTN: DCHRG_C7.2 DCHRG_C8.2 DCHRG_C9.2 DCHRG_Q2.E DCHRG_Q3.E DCHRG_R7.2 DCHRG_R8.2 DCHRG_R9.2 DCHRG_R10.2 DCHRG_REF1.2(A) DCHRG_REF1.3(NC) DCHRG_U3.5(GND) DCHRG_U3.6(NC) ; port BatDchrgLclRtn
DCHRG_LCL_FB: DCHRG_U3.7(FLAGB) ; port DchrgLCL_N.LCL_FB
DCHRG_LCL_PG: DCHRG_U3.2(PGOOD) ; port DchrgLCL_N.LCL_PG
DCHRG_LCLN_ON: DCHRG_R6.2 ; port DchrgLCL_N.LCL_ON
DCHRG_LCLR_ON: DCHRG_R11.2 ; port DchrgLCL_R.LCL_ON
NetBAT_C2_1: DCHRG_R3.1 DCHRG_U3.1(VIN) ; port BatDchrgLclIn
NetCHRG_C3_1: DCHRG_C5.1 DCHRG_C6.1 DCHRG_R4.1 DCHRG_R5.1 DCHRG_U3.8(VOUT) ; port BatDchrgLclOut
NetDCHRG_C5_2: DCHRG_C5.2 DCHRG_C7.1 DCHRG_R4.2 DCHRG_R7.1
NetDCHRG_C6_2: DCHRG_C6.2 DCHRG_C8.1 DCHRG_R5.2 DCHRG_R8.1
NetDCHRG_C9_1: DCHRG_C9.1 DCHRG_Q2.C DCHRG_Q2.Shield DCHRG_Q3.C DCHRG_Q3.Shield DCHRG_R3.2 DCHRG_R9.1 DCHRG_REF1.1(K) DCHRG_U3.4(ON)
NetDCHRG_Q2_B: DCHRG_Q2.B DCHRG_R6.1
NetDCHRG_Q3_B: DCHRG_Q3.B DCHRG_R11.1
NetDCHRG_R10_1: DCHRG_R10.1 DCHRG_U3.3(ISET)

### Notes on the sheet
- (near DCHRG_U3) V
- V
- (near DCHRG_C9) V
- (near DCHRG_R6) V
- (near DCHRG_Q2) V
- (near DCHRG_REF1) V
- (near DCHRG_R9) V
- (near DCHRG_R10) V
- 3x470k
- (near DCHRG_C8) V
- (near DCHRG_R11) V
- Title:
- Sheet:
- of
- Author:
- Model:
- Document Number:
- Checked by:
- Iss-Rev:
- Approved by:
- Date:
- File name:

### Library data of the parts
DCHRG_C5-DCHRG_C8 = Cer_GCJ32ER71E106KA12L: as BAT_C1 on sheet battery_current-meas; Manufacturer: Murata; ManufacturerPartNumber: GCJ32ER71E106KA12L; Value: 10u/25V
DCHRG_C9 = Cer_C1206T105K3RALTU: Ceramic Cap Kemet COTS 1u/25V X7R 1206; ManufacturerPartNumber: C1206T105K3RALTU; Manufacturer: Kemet; Value: 1u/25V
DCHRG_Q2 DCHRG_Q3 = 2N2222ACSM: as CHRG_Q2 on sheet battery_lcl-charging; Value: 2N2222ACSM
DCHRG_R3 = CRCW040215K0FKxxxx: as CHRG_R3 on sheet battery_lcl-charging; Manufacturer: Vishay; ManufacturerPartNumber: CRCW040215K0FKxxxx; Value: 15k/1%
DCHRG_R4 DCHRG_R5 DCHRG_R7 DCHRG_R8 = CRCW0603470KFKxxxx: as BAT_R2 on sheet battery_current-meas; Manufacturer: Vishay; ManufacturerPartNumber: CRCW0603470KFKxxxx; Value: 470k/1%
DCHRG_R6 DCHRG_R9 DCHRG_R11 = CRCW040222K0FKxxxx: as CHRG_R8 on sheet battery_lcl-charging; Manufacturer: Vishay; ManufacturerPartNumber: CRCW040222K0FKxxxx; Value: 22k/1%
DCHRG_R10 = CRCW0402150KFKxxxx: as CHRG_R9 on sheet battery_lcl-charging; Manufacturer: Vishay; ManufacturerPartNumber: CRCW0402150KFKxxxx; Value: 150k/1%
DCHRG_REF1 = LM4040DIM3-5.0: as CHRG_REF1 on sheet battery_lcl-charging; ManufacturerPartNumber: LM4040DIM3-5.0; Value: LM4040-5V 1%
DCHRG_U3 = FPF2700MX: as CHRG_U3 on sheet battery_lcl-charging; Value: FPF2700MX

## Sheet battery_voltage-meas.SchDoc: Battery Voltage Measurement
size A4; Date: 2015-09-21; Author: Piotr Kuligowski; DocumentNumber: 1; Revision: 1-0; SheetNumber: 1; SheetTotal: 14; Model: EM1
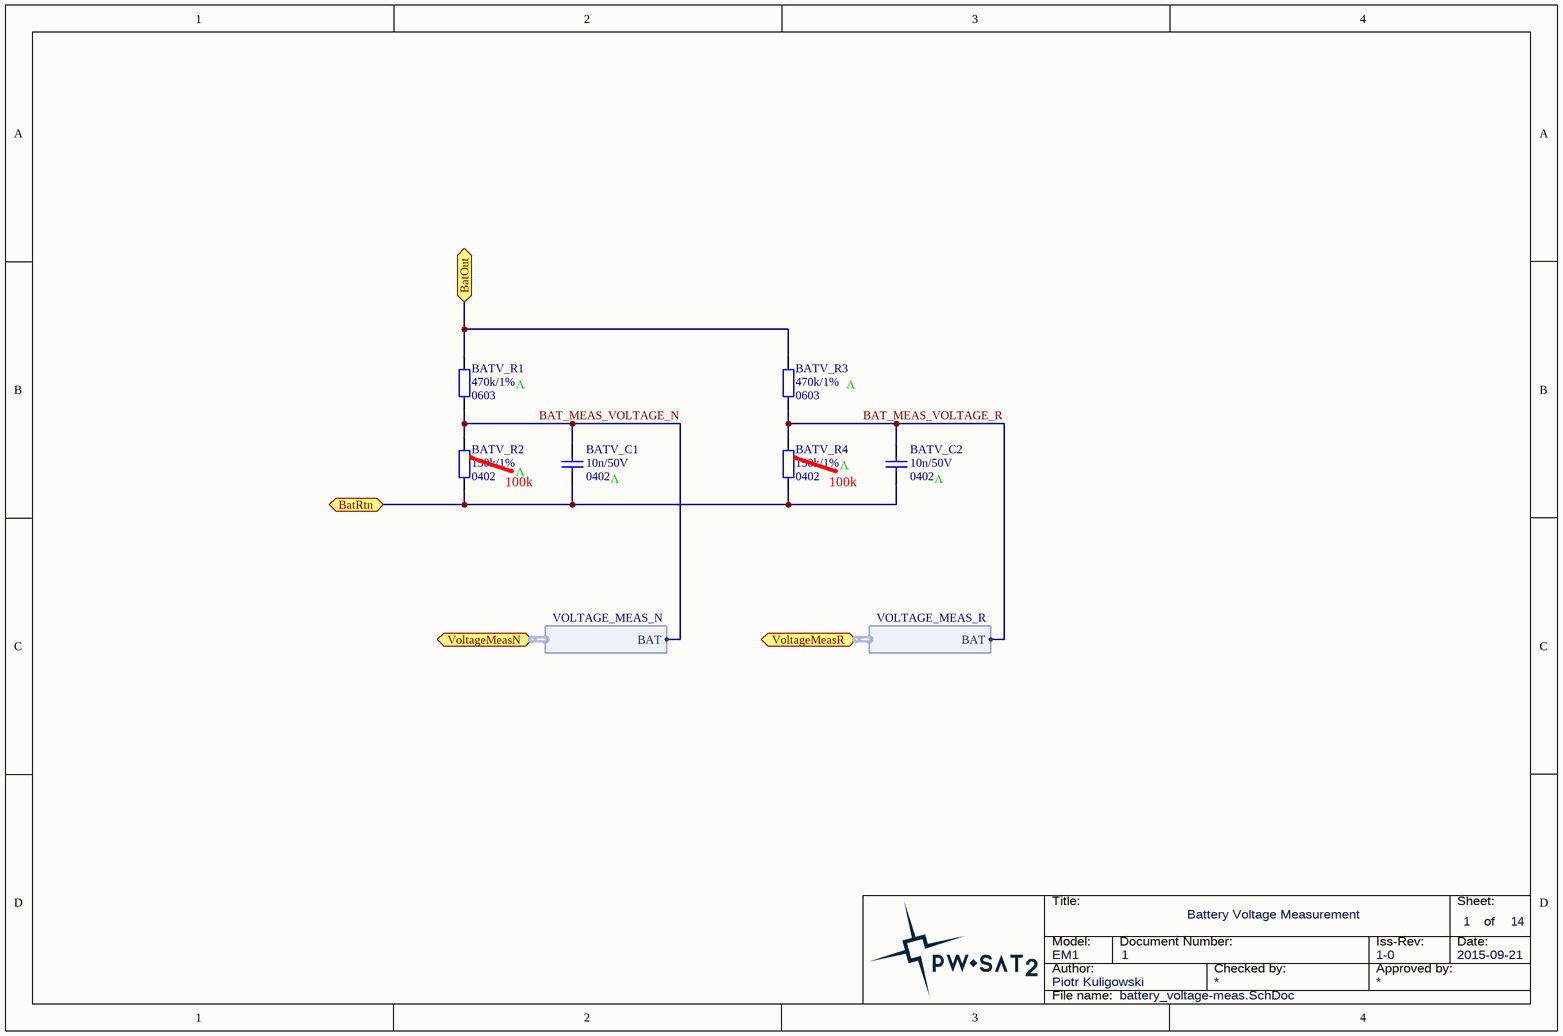
[diagram p7: battery_voltage-meas.SchDoc]

### Parts
BATV_C1  Package: 0402  [SMD_Capacitor_0402]  (hidden comment: 10n/50V)
BATV_C2  Package: 0402  [SMD_Capacitor_0402]  (hidden comment: 10n/50V)
BATV_R1  Package: 0603  [SMD_Resistor_0603]  (hidden comment: 470k/1%)
BATV_R2  Package: 0402  [SMD_Resistor_0402]  (hidden comment: 150k/1%)
BATV_R3  Package: 0603  [SMD_Resistor_0603]  (hidden comment: 470k/1%)
BATV_R4  Package: 0402  [SMD_Resistor_0402]  (hidden comment: 150k/1%)

### Ports
BatOut, BatRtn, VoltageMeasN (harness VOLTAGE_MEAS_N), VoltageMeasR (harness VOLTAGE_MEAS_R)

### Harnesses
VOLTAGE_MEAS_N: BAT
VOLTAGE_MEAS_R: BAT

### Nets
BAT_RTN: BATV_C1.2 BATV_C2.2 BATV_R2.2 BATV_R4.2 ; port BatRtn
BAT_MEAS_VOLTAGE_N: BATV_C1.1 BATV_R1.2 BATV_R2.1 ; port VoltageMeasN.BAT
BAT_MEAS_VOLTAGE_R: BATV_C2.1 BATV_R3.2 BATV_R4.1 ; port VoltageMeasR.BAT
NetBATV_R1_1: BATV_R1.1 BATV_R3.1 ; port BatOut

### Notes on the sheet
- V
- 100k
- (near BATV_C1) V
- (near BATV_C2) V
- Title:
- Sheet:
- of
- Author:
- Model:
- Document Number:
- Checked by:
- Iss-Rev:
- Approved by:
- Date:
- File name:

### Library data of the parts
BATV_C1 BATV_C2 = Cer_GCM155R71H103KA55D: Ceramic Cap Murata Automotive 10n/50V X7R 0402; Manufacturer: Murata; ManufacturerPartNumber: GCM155R71H103KA55D; Value: 10n/50V
BATV_R1 BATV_R3 = CRCW0603470KFKxxxx: as BAT_R2 on sheet battery_current-meas; Manufacturer: Vishay; ManufacturerPartNumber: CRCW0603470KFKxxxx; Value: 470k/1%
BATV_R2 BATV_R4 = CRCW0402150KFKxxxx: as CHRG_R9 on sheet battery_lcl-charging; Manufacturer: Vishay; ManufacturerPartNumber: CRCW0402150KFKxxxx; Value: 150k/1%

## Nets that join several sheets
BAT_RTN: top_power (6 pins), battery_current-meas (10 pins), battery_diode-charging (CHRG_R2.2), battery_diode-discharging (DCHRG_R2.2), battery_lcl-charging (13 pins), battery_lcl-discharging (13 pins), battery_voltage-meas (BATV_C1.2 BATV_C2.2 BATV_R2.2 BATV_R4.2)
BAT_MEAS_VOLTAGE_N: top_power (TOP_H1.2), battery_voltage-meas (BATV_C1.1 BATV_R1.2 BATV_R2.1)
BAT_MEAS_VOLTAGE_R: top_power (TOP_H3.2), battery_voltage-meas (BATV_C2.1 BATV_R3.2 BATV_R4.1)
CHRG_ID_STAT: top_power (TOP_H2.4 TOP_R6.1), battery_diode-charging (CHRG_U1.4)
CHRG_LCL_FB: top_power (TOP_H2.8 TOP_R2.2), battery_lcl-charging (CHRG_U3.7)
CHRG_LCL_PG: top_power (TOP_H2.10 TOP_R3.2), battery_lcl-charging (CHRG_U3.2)
CHRG_LCLN_ON: top_power (TOP_H1.4), battery_lcl-charging (CHRG_R8.2)
CHRG_LCLR_ON: top_power (TOP_H3.4), battery_lcl-charging (CHRG_R11.2)
CHRG_MEAS_CURRENT: top_power (TOP_H2.9), battery_current-meas (CHRG_U2.2)
DCHRG_ID_STAT: top_power (TOP_H2.6 TOP_R1.2), battery_diode-discharging (DCHRG_U1.4)
DCHRG_LCL_FB: top_power (TOP_H2.5 TOP_R4.1), battery_lcl-discharging (DCHRG_U3.7)
DCHRG_LCL_PG: top_power (TOP_H2.3 TOP_R5.1), battery_lcl-discharging (DCHRG_U3.2)
DCHRG_LCLN_ON: top_power (TOP_H1.3), battery_lcl-discharging (DCHRG_R6.2)
DCHRG_LCLR_ON: top_power (TOP_H3.3), battery_lcl-discharging (DCHRG_R11.2)
DCHRG_MEAS_CURRENT: top_power (TOP_H2.7), battery_current-meas (DCHRG_U2.2)
NetBAT_C1_1: battery_current-meas (BAT_C1.1 BAT_R1.1 BAT_R2.1 DCHRG_R1.1), battery_diode-discharging (DCHRG_D1.K DCHRG_Q1.S DCHRG_U1.6), battery_lcl-charging (CHRG_R3.1 CHRG_U3.1)
NetBAT_C2_1: battery_current-meas (BAT_C2.1 BAT_R1.4 BAT_R3.1 CHRG_R1.1), battery_diode-charging (CHRG_D1.K CHRG_Q1.S CHRG_U1.6), battery_lcl-discharging (DCHRG_R3.1 DCHRG_U3.1)
NetBATV_R1_1: top_power (TOP_K1.2), battery_diode-discharging (5 pins), battery_lcl-charging (5 pins), battery_voltage-meas (BATV_R1.1 BATV_R3.1)
NetCHRG_C3_1: top_power (TOP_K2.2), battery_diode-charging (5 pins), battery_lcl-discharging (5 pins)